# EAGLE schematic Backplane_Compact_R2_1_Panel_3U18HP (EAGLE 6.6.0)
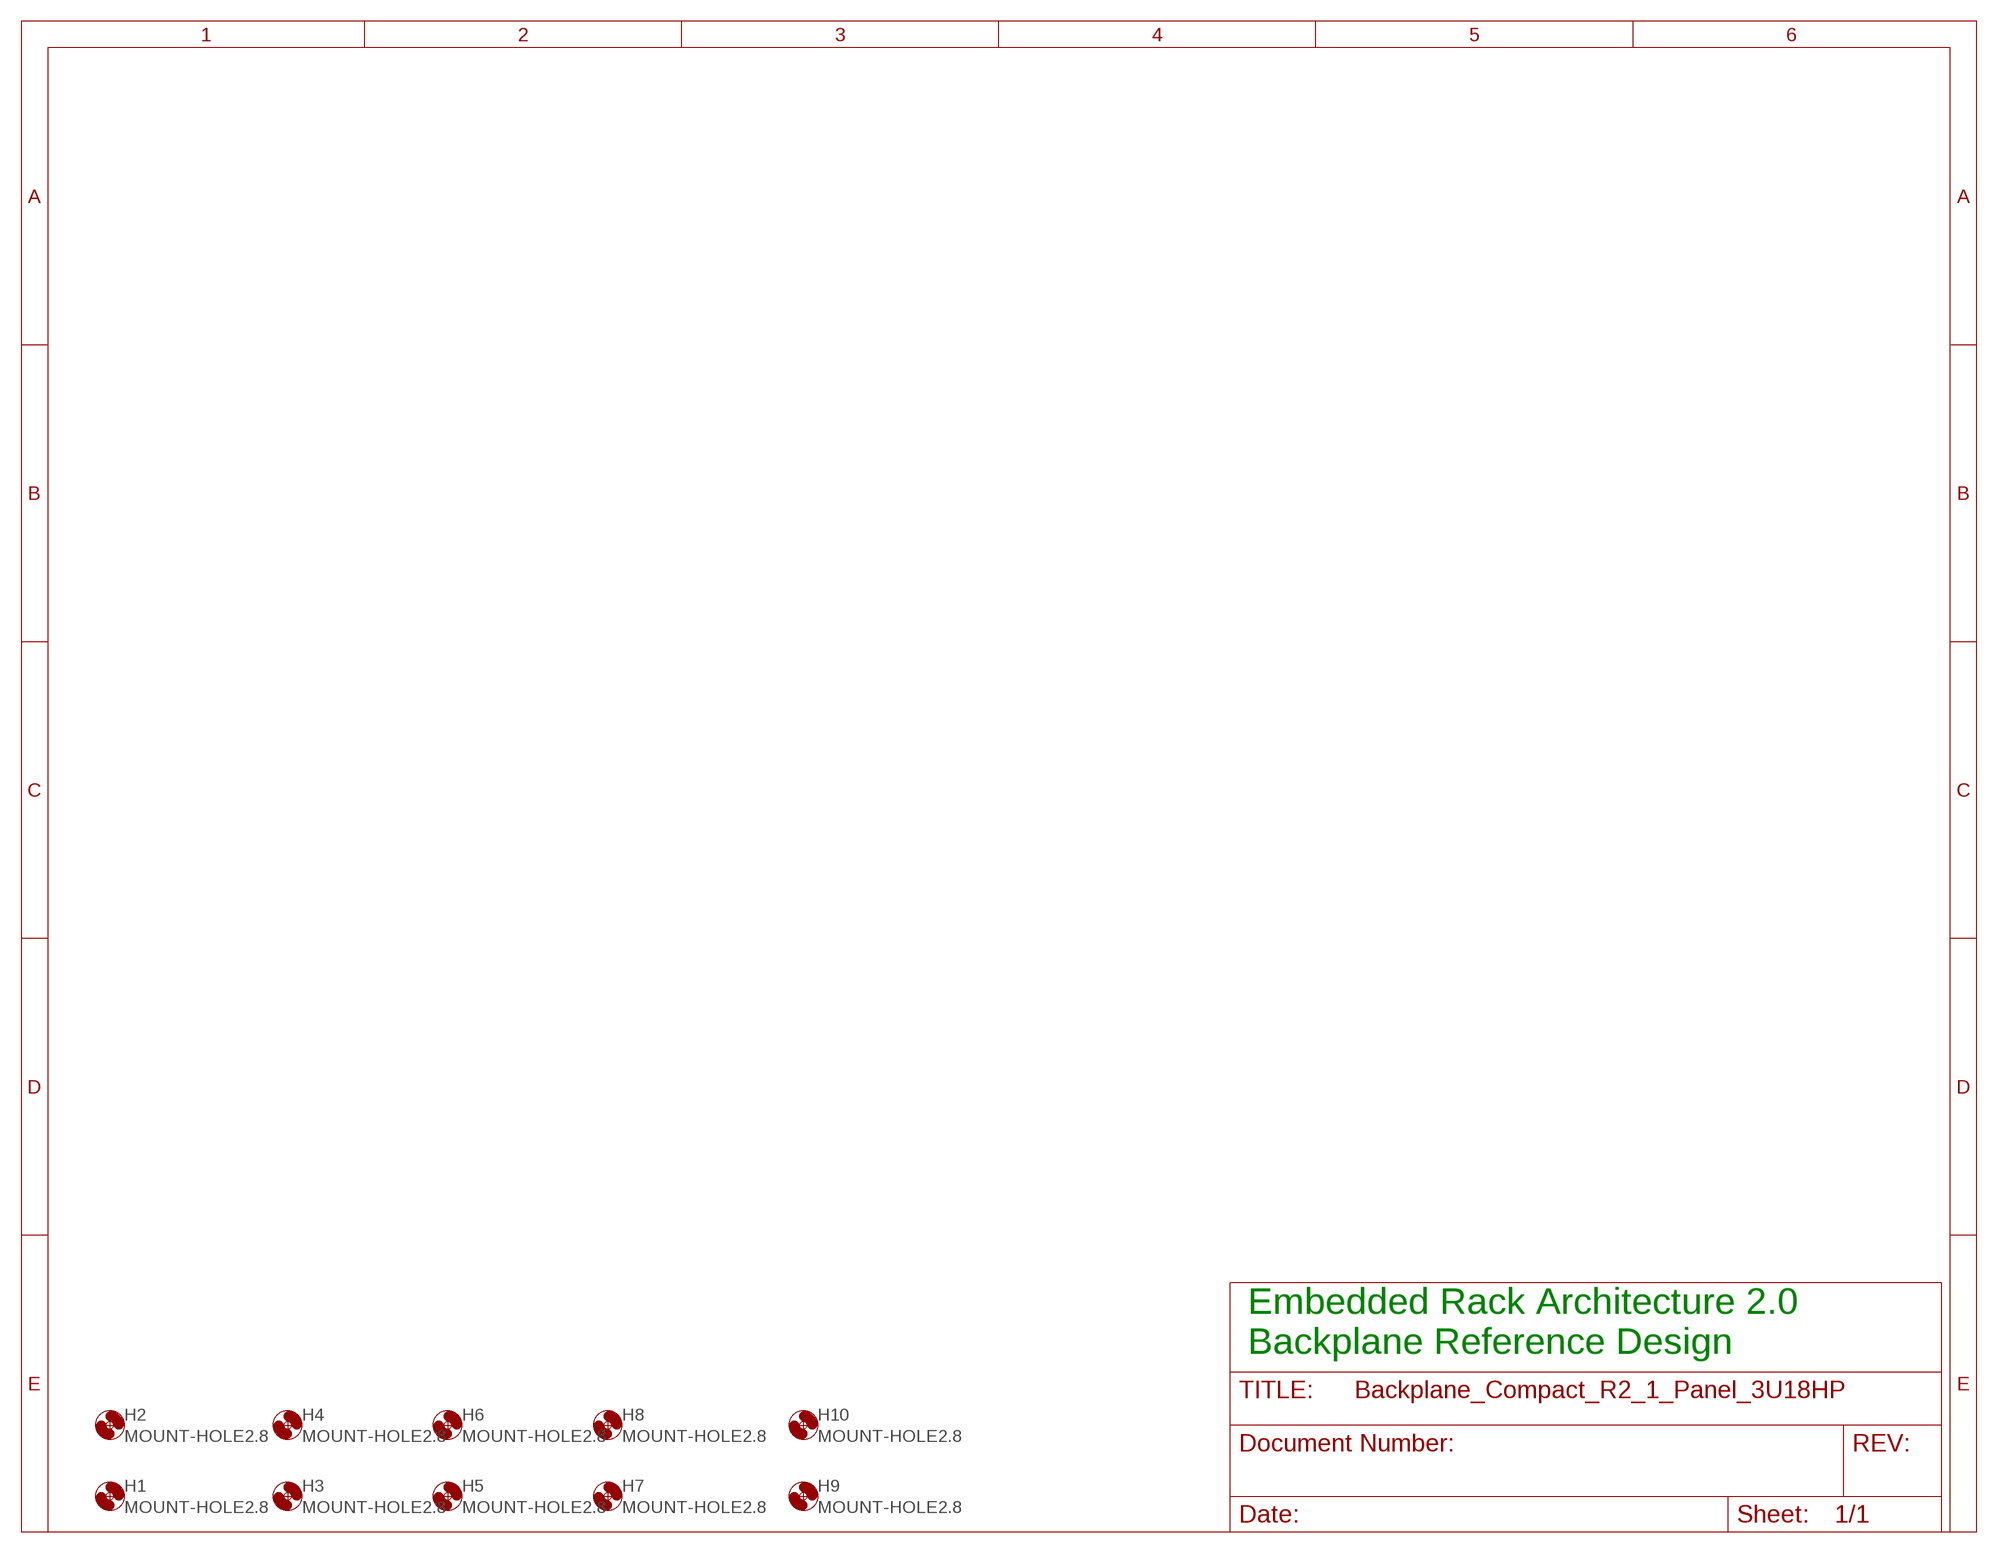
[diagram p0: schematic, sheet 1]

## Parts
H1  MOUNT-HOLE2.8  [2,8]
H2  MOUNT-HOLE2.8  [2,8]
H3  MOUNT-HOLE2.8  [2,8]
H4  MOUNT-HOLE2.8  [2,8]
H5  MOUNT-HOLE2.8  [2,8]
H6  MOUNT-HOLE2.8  [2,8]
H7  MOUNT-HOLE2.8  [2,8]
H8  MOUNT-HOLE2.8  [2,8]
H9  MOUNT-HOLE2.8  [2,8]
H10  MOUNT-HOLE2.8  [2,8]

## Notes on the sheet
- Embedded Rack Architecture 2.0
  Backplane Reference Design

## Library data of the parts
H1-H10 = euro_rack:MOUNT-HOLE: MOUNTING HOLE with drill center marker